# Altium schematic sheet bh_gateway_alph.SchDoc
size A4
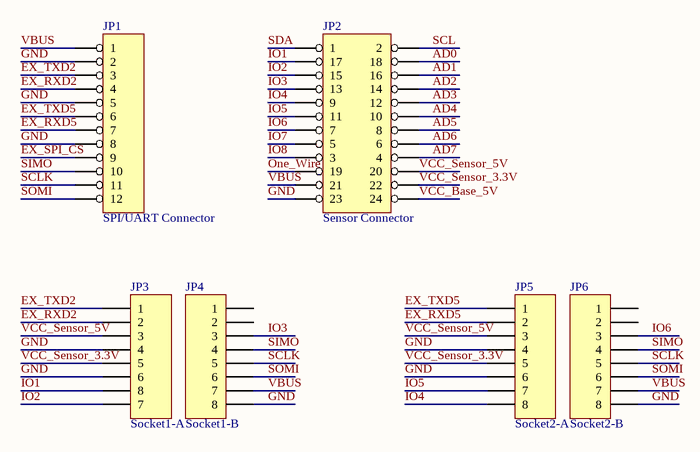
[diagram p0: bh_gateway_alph.SchDoc]

## Parts
JP1  SPI/UART Connector  [SIP1x12x2.54]
JP2  Sensor Connector  [SIP2X12X2.54]
JP3  Socket1-A  [SIP1x8x2.0]
JP4  Socket1-B  [SIP1x8x2.0]
JP5  Socket2-A  [SIP1x8x2.0]
JP6  Socket2-B  [SIP1x8x2.0]

## Nets
AD0: JP2.18
AD1: JP2.16
AD2: JP2.14
AD3: JP2.12
AD4: JP2.10
AD5: JP2.8
AD6: JP2.6
AD7: JP2.4
EX_RXD2: JP1.4 JP3.2
EX_RXD5: JP1.7 JP5.2
EX_SPI_CS: JP1.9
EX_TXD2: JP1.3 JP3.1
EX_TXD5: JP1.6 JP5.1
GND: JP1.2 JP1.5 JP1.8 JP2.23 JP3.4 JP3.6 JP4.8 JP5.4 JP5.6 JP6.8
IO1: JP2.17 JP3.8
IO2: JP2.15 JP3.7
IO3: JP2.13 JP4.3
IO4: JP2.9 JP5.8
IO5: JP2.11 JP5.7
IO6: JP2.7 JP6.3
IO7: JP2.5
IO8: JP2.3
One_Wire: JP2.19
SCL: JP2.2
SCLK: JP1.11 JP4.5 JP6.5
SDA: JP2.1
SIMO: JP1.10 JP4.4 JP6.4
SOMI: JP1.12 JP4.6 JP6.6
VBUS: JP1.1 JP2.21 JP4.7 JP6.7
VCC_Base_5V: JP2.24
VCC_Sensor_3.3V: JP2.22 JP3.5 JP5.5
VCC_Sensor_5V: JP2.20 JP3.3 JP5.3

Not connected (* = marked no-connect by the designer): JP4 1 2; JP6 1 2

## Library data of the parts
JP1 = SIP1X12: 单排排针直角
JP2 = SIP2X12: 双排排针直角
JP3 JP5 = SIP1X8
JP4 JP6 = SIP1X8: 8 Pin Header